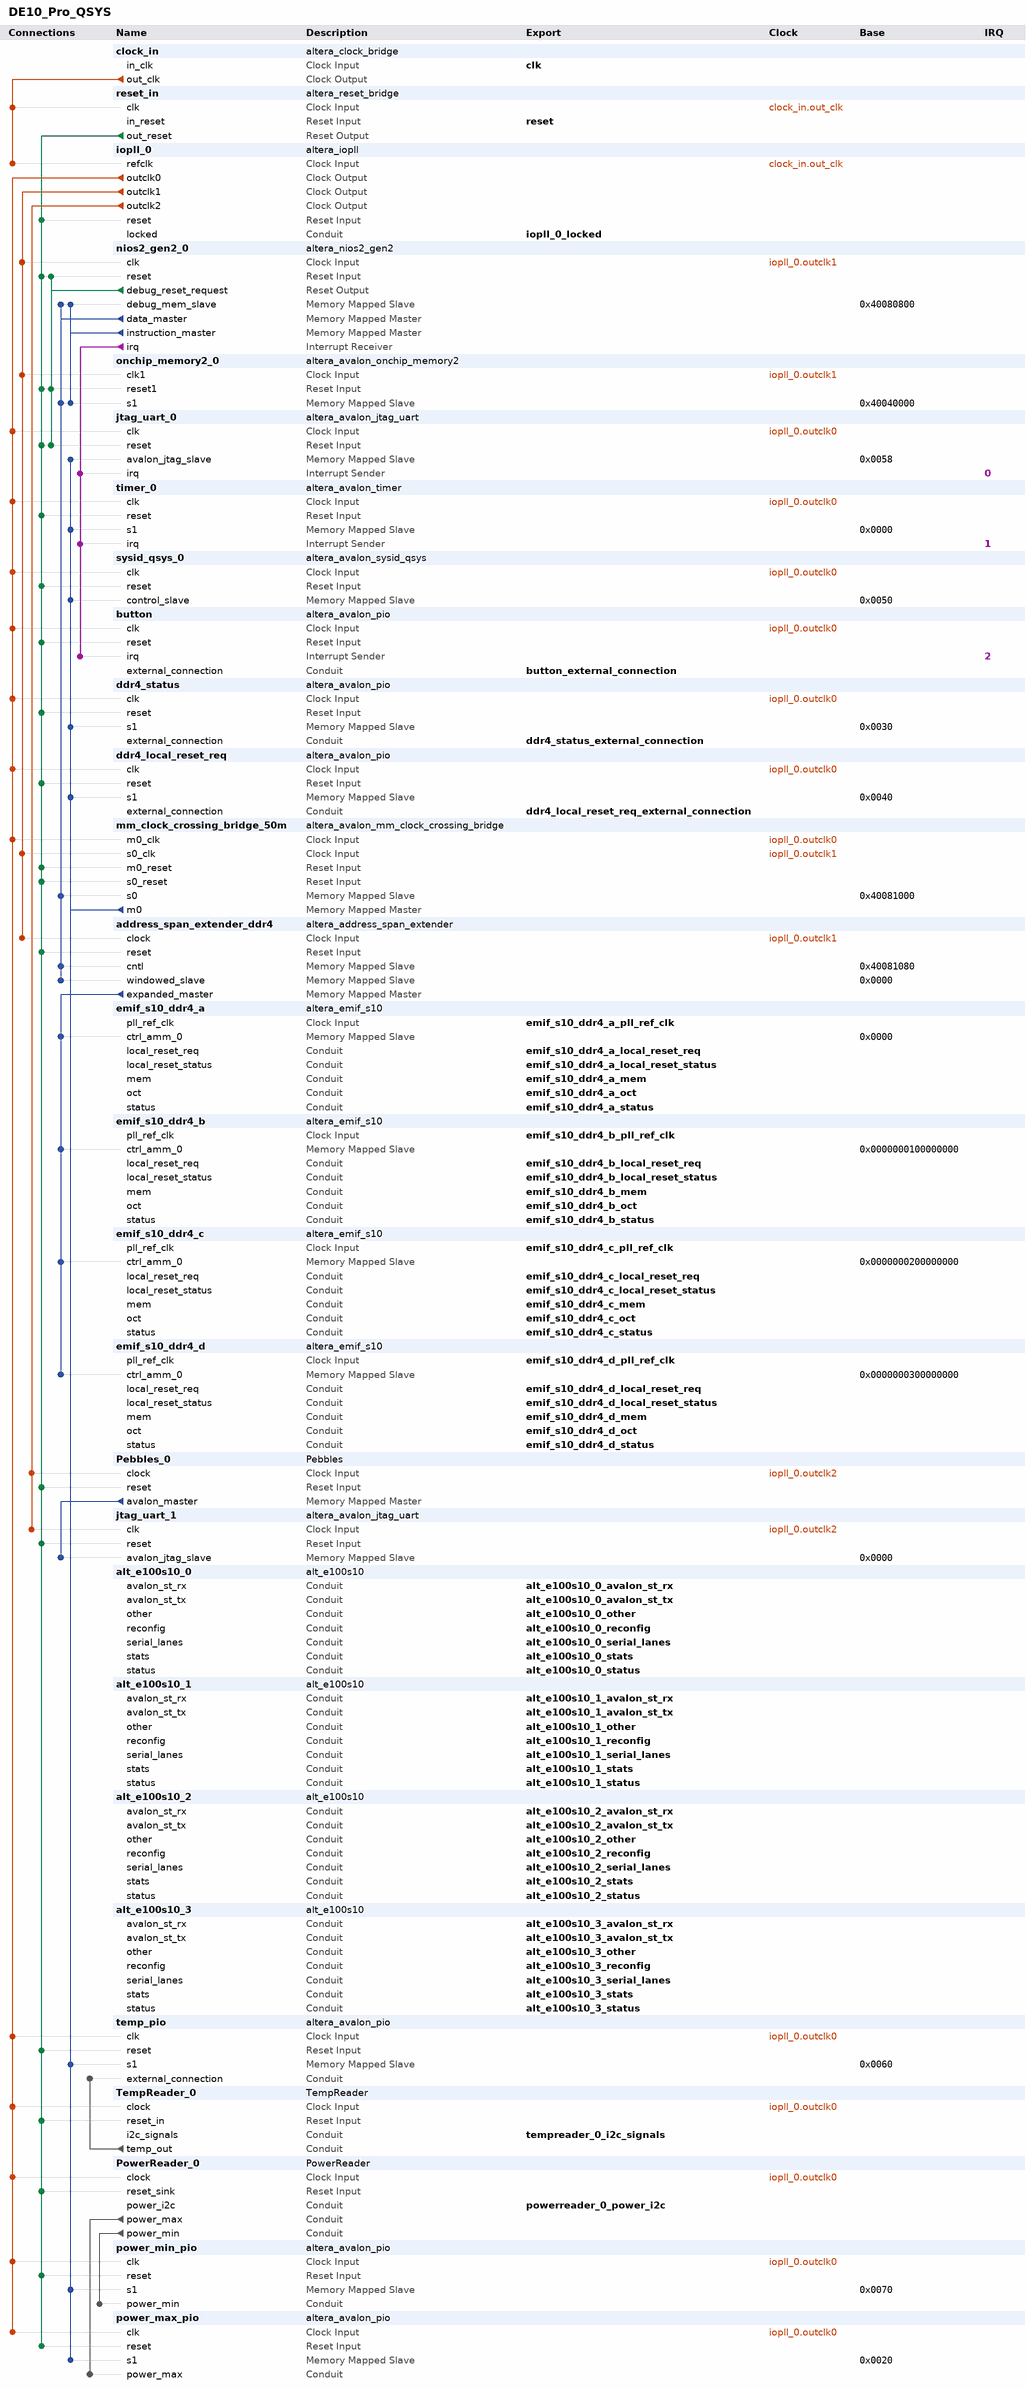
[diagram p0: system contents]
# Platform Designer (Qsys) system DE10_Pro_QSYS, Stratix 10 1SX280HU2F50E1VG
# Parameters at their usual value, and those the tool derives, are not listed.
package require -exact qsys 1.0
create_system DE10_Pro_QSYS
set_project_property DEVICE_FAMILY {Stratix 10}
set_project_property DEVICE 1SX280HU2F50E1VG

add_component clock_in ip/DE10_Pro_QSYS/DE10_Pro_QSYS_clock_in.ip altera_clock_bridge clock_in 19.1

add_component reset_in ip/DE10_Pro_QSYS/DE10_Pro_QSYS_reset_in.ip altera_reset_bridge reset_in 19.1

add_component iopll_0 ip/DE10_Pro_QSYS/DE10_Pro_QSYS_iopll_0.ip altera_iopll iopll_0 19.1
load_component iopll_0
set_component_parameter_value gui_device_family {Stratix 10}
set_component_parameter_value gui_device_component 1SX280HU2F50E1VG
set_component_parameter_value gui_device_speed_grade 1
set_component_parameter_value gui_debug_mode false
set_component_parameter_value gui_skip_sdc_generation false
set_component_parameter_value gui_include_iossm false
set_component_parameter_value gui_cal_code_hex_file iossm.hex
set_component_parameter_value gui_parameter_table_hex_file seq_params_sim.hex
set_component_parameter_value gui_pll_tclk_mux_en false
set_component_parameter_value gui_pll_tclk_sel pll_tclk_m_src
set_component_parameter_value gui_pll_vco_freq_band_0 pll_freq_clk0_disabled
set_component_parameter_value gui_pll_vco_freq_band_1 pll_freq_clk1_disabled
set_component_parameter_value gui_pll_freqcal_en true
set_component_parameter_value gui_pll_freqcal_req_flag true
set_component_parameter_value gui_cal_converge false
set_component_parameter_value gui_cal_error cal_clean
set_component_parameter_value gui_pll_cal_done false
set_component_parameter_value gui_pll_type S10_Simple
set_component_parameter_value gui_pll_m_cnt_in_src c_m_cnt_in_src_ph_mux_clk
set_component_parameter_value gui_c_cnt_in_src0 c_m_cnt_in_src_ph_mux_clk
set_component_parameter_value gui_c_cnt_in_src1 c_m_cnt_in_src_ph_mux_clk
set_component_parameter_value gui_c_cnt_in_src2 c_m_cnt_in_src_ph_mux_clk
set_component_parameter_value system_info_device_family {Stratix 10}
set_component_parameter_value system_info_device_component 1SX280HU2F50E1VG
set_component_parameter_value system_info_device_speed_grade 1
set_component_parameter_value system_part_trait_speed_grade 1
set_component_parameter_value gui_usr_device_speed_grade 1
set_component_parameter_value gui_location_type {I/O Bank}
set_component_parameter_value gui_use_logical false
set_component_parameter_value gui_reference_clock_frequency 50.0
set_component_parameter_value gui_reference_clock_frequency_ps 10000.0
set_component_parameter_value gui_use_coreclk false
set_component_parameter_value gui_refclk_might_change false
set_component_parameter_value gui_prot_mode UNUSED
set_component_parameter_value gui_use_locked true
set_component_parameter_value gui_lock_setting {Low Lock Time}
set_component_parameter_value gui_en_lvds_ports Disabled
set_component_parameter_value gui_operation_mode normal
set_component_parameter_value gui_clock_to_compensate 0
set_component_parameter_value gui_use_NDFB_modes false
set_component_parameter_value gui_number_of_clocks 3
set_component_parameter_value gui_fixed_vco_frequency_ps 1667.0
set_component_parameter_value gui_vco_frequency 600.0
set_component_parameter_value gui_mif_gen_options {Generate New MIF File}
set_component_parameter_value gui_new_mif_file_path {~/pll.mif}
set_component_parameter_value gui_existing_mif_file_path {~/pll.mif}
set_component_parameter_value gui_mif_config_name unnamed
set_component_parameter_value gui_enable_permit_cal false
set_component_parameter_value gui_clock_name_global false
set_component_parameter_value gui_output_clock_frequency0 50.0
set_component_parameter_value gui_output_clock_frequency1 200.0
set_component_parameter_value gui_output_clock_frequency2 150.0
set_component_parameter_value gui_output_clock_frequency_ps0 10000.0
set_component_parameter_value gui_output_clock_frequency_ps1 10000.0
set_component_parameter_value gui_output_clock_frequency_ps2 6666.667
set_component_parameter_value gui_actual_output_clock_frequency0 50.0
set_component_parameter_value gui_actual_output_clock_frequency1 200.0
set_component_parameter_value gui_actual_output_clock_frequency2 150.0
set_component_parameter_value gui_actual_output_clock_frequency_range0 49.666667,49.677419,49.6875,50.0,50.322581,50.333333
set_component_parameter_value gui_actual_output_clock_frequency_range1 191.666667,192.857143,193.75,200.0,207.142857,208.333333
set_component_parameter_value gui_actual_output_clock_frequency_range2 140.0,142.857143,145.454545,150.0,155.555556,160.0
set_component_parameter_value gui_actual_phase_shift0 0.0
set_component_parameter_value gui_actual_phase_shift1 0.0
set_component_parameter_value gui_actual_phase_shift2 0.0
set_component_parameter_value gui_actual_phase_shift_range0 0.0,104.2,208.3,312.5,416.7,520.8
set_component_parameter_value gui_actual_phase_shift_range1 0.0,104.2,208.3,312.5,416.7,520.8
set_component_parameter_value gui_actual_phase_shift_range2 0.0,104.2,208.3,312.5,416.7,520.8
set_component_parameter_value gui_actual_phase_shift_deg0 0.0
set_component_parameter_value gui_actual_phase_shift_deg1 0.0
set_component_parameter_value gui_actual_phase_shift_deg2 0.0
set_component_parameter_value gui_actual_phase_shift_deg_range0 0.0,1.9,3.8,5.6,7.5,9.4
set_component_parameter_value gui_actual_phase_shift_deg_range1 0.0,7.5,15.0,22.5,30.0,37.5
set_component_parameter_value gui_actual_phase_shift_deg_range2 0.0,5.6,11.2,16.9,22.5,28.1
set_component_parameter_value gui_actual_duty_cycle0 50.0
set_component_parameter_value gui_actual_duty_cycle1 50.0
set_component_parameter_value gui_actual_duty_cycle2 50.0
set_component_parameter_value gui_actual_duty_cycle_range0 43.75,45.83,47.92,50.0,52.08,54.17
set_component_parameter_value gui_actual_duty_cycle_range1 25.0,33.33,41.67,50.0,58.33,66.67
set_component_parameter_value gui_actual_duty_cycle_range2 31.25,37.5,43.75,50.0,56.25,62.5
set_component_parameter_value parameterTable_names {M-Counter Divide Setting,N-Counter Divide Setting,VCO Frequency,C-Counter-0 Divide Setting,C-Counter-1 Divide Setting,C-Counter-2 Divide Setting,C-Counter-3 Divide Setting,C-Counter-4 Divide Setting,C-Counter-5 Divide Setting,C-Counter-6 Divide Setting,C-Counter-7 Divide Setting,C-Counter-8 Divide Setting,PLL Auto Reset,M-Counter Hi Divide,M-Counter Lo Divide,M-Counter Even Duty Enable,M-Counter Bypass Enable,N-Counter Hi Divide,N-Counter Lo Divide,N-Counter Even Duty Enable,N-Counter Bypass Enable,C-Counter-0 Hi Divide,C-Counter-1 Hi Divide,C-Counter-2 Hi Divide,C-Counter-3 Hi Divide,C-Counter-4 Hi Divide,C-Counter-5 Hi Divide,C-Counter-6 Hi Divide,C-Counter-7 Hi Divide,C-Counter-8 Hi Divide,C-Counter-0 Lo Divide,C-Counter-1 Lo Divide,C-Counter-2 Lo Divide,C-Counter-3 Lo Divide,C-Counter-4 Lo Divide,C-Counter-5 Lo Divide,C-Counter-6 Lo Divide,C-Counter-7 Lo Divide,C-Counter-8 Lo Divide,C-Counter-0 Even Duty Enable,C-Counter-1 Even Duty Enable,C-Counter-2 Even Duty Enable,C-Counter-3 Even Duty Enable,C-Counter-4 Even Duty Enable,C-Counter-5 Even Duty Enable,C-Counter-6 Even Duty Enable,C-Counter-7 Even Duty Enable,C-Counter-8 Even Duty Enable,C-Counter-0 Bypass Enable,C-Counter-1 Bypass Enable,C-Counter-2 Bypass Enable,C-Counter-3 Bypass Enable,C-Counter-4 Bypass Enable,C-Counter-5 Bypass Enable,C-Counter-6 Bypass Enable,C-Counter-7 Bypass Enable,C-Counter-8 Bypass Enable,C-Counter-0 Preset,C-Counter-1 Preset,C-Counter-2 Preset,C-Counter-3 Preset,C-Counter-4 Preset,C-Counter-5 Preset,C-Counter-6 Preset,C-Counter-7 Preset,C-Counter-8 Preset,C-Counter-0 Phase Mux Preset,C-Counter-1 Phase Mux Preset,C-Counter-2 Phase Mux Preset,C-Counter-3 Phase Mux Preset,C-Counter-4 Phase Mux Preset,C-Counter-5 Phase Mux Preset,C-Counter-6 Phase Mux Preset,C-Counter-7 Phase Mux Preset,C-Counter-8 Phase Mux Preset,Charge Pump Current,Bandwidth Control}
set_component_parameter_value parameterTable_values {24,1,1200.0 MHz,24,6,8,1,1,1,1,1,1,false,12,12,false,false,256,256,false,true,12,3,4,256,256,256,256,256,256,12,3,4,256,256,256,256,256,256,false,false,false,false,false,false,false,false,false,false,false,false,true,true,true,true,true,true,1,1,1,1,1,1,1,1,1,0,0,0,0,0,0,0,0,0,pll_cp_setting4,pll_bw_res_setting4}
set_component_parameter_value mifTable_names {The MIF file specified does not yet exist}
set_component_parameter_value pll_m_cnt_basic 1
set_component_parameter_value pll_m_cnt 1
set_component_parameter_value prot_mode BASIC
set_component_parameter_value m_cnt_hi_div 12
set_component_parameter_value eff_m_cnt 1
set_component_parameter_value multiply_factor 24
set_component_parameter_value use_core_refclk false
set_component_parameter_value m_cnt_lo_div 12
set_component_parameter_value n_cnt_hi_div 256
set_component_parameter_value n_cnt_lo_div 256
set_component_parameter_value m_cnt_bypass_en false
set_component_parameter_value n_cnt_bypass_en true
set_component_parameter_value m_cnt_odd_div_duty_en false
set_component_parameter_value n_cnt_odd_div_duty_en false
set_component_parameter_value pll_vco_div 1
set_component_parameter_value pll_cp_current pll_cp_setting4
set_component_parameter_value pll_bwctrl pll_bw_res_setting4
set_component_parameter_value pll_ripplecap_ctrl pll_ripplecap_setting0
set_component_parameter_value pll_fractional_division 1
set_component_parameter_value fractional_vco_multiplier false
set_component_parameter_value reference_clock_frequency {50.0 MHz}
set_component_parameter_value pll_fractional_cout 1
set_component_parameter_value pll_dsm_out_sel 1st_order
set_component_parameter_value operation_mode normal
set_component_parameter_value number_of_clocks 3
set_component_parameter_value number_of_outclks 3
set_component_parameter_value pll_vcoph_div 1
set_component_parameter_value pll_type S10_Simple
set_component_parameter_value pll_subtype General
set_component_parameter_value pll_output_clk_frequency {1200.0 MHz}
set_component_parameter_value pll_pfd_frequency {50.0 MHz}
set_component_parameter_value mimic_fbclk_type gclk
set_component_parameter_value pll_bw_sel low_bw
set_component_parameter_value pll_slf_rst false
set_component_parameter_value pll_fbclk_mux_1 pll_fbclk_mux_1_glb
set_component_parameter_value pll_fbclk_mux_2 pll_fbclk_mux_2_fb_1
set_component_parameter_value pll_m_cnt_in_src c_m_cnt_in_src_ph_mux_clk
set_component_parameter_value pll_clkin_0_src clk_0
set_component_parameter_value refclk1_frequency {100.0 MHz}
set_component_parameter_value pll_clk_loss_sw_en false
set_component_parameter_value pll_manu_clk_sw_en false
set_component_parameter_value pll_auto_clk_sw_en false
set_component_parameter_value pll_clkin_1_src clk_0
set_component_parameter_value pll_clk_sw_dly 0
set_component_parameter_value pll_extclk_0_cnt_src pll_extclk_cnt_src_vss
set_component_parameter_value pll_extclk_1_cnt_src pll_extclk_cnt_src_vss
set_component_parameter_value pll_lock_fltr_cfg 100
set_component_parameter_value pll_unlock_fltr_cfg 2
set_component_parameter_value lock_mode low_lock_time
set_component_parameter_value clock_to_compensate 0
set_component_parameter_value clock_name_global false
set_component_parameter_value pll_freqcal_en true
set_component_parameter_value pll_defer_cal_user_mode false
set_component_parameter_value dprio_interface_sel 3
set_component_parameter_value merging_permitted false
set_component_parameter_value c_cnt_hi_div0 12
set_component_parameter_value c_cnt_hi_div1 3
set_component_parameter_value c_cnt_hi_div2 4
set_component_parameter_value c_cnt_hi_div3 256
set_component_parameter_value c_cnt_hi_div4 256
set_component_parameter_value c_cnt_hi_div5 256
set_component_parameter_value c_cnt_hi_div6 256
set_component_parameter_value c_cnt_hi_div7 256
set_component_parameter_value c_cnt_hi_div8 256
set_component_parameter_value c_cnt_hi_div9 1
set_component_parameter_value c_cnt_hi_div10 1
set_component_parameter_value c_cnt_hi_div11 1
set_component_parameter_value c_cnt_hi_div12 1
set_component_parameter_value c_cnt_hi_div13 1
set_component_parameter_value c_cnt_hi_div14 1
set_component_parameter_value c_cnt_hi_div15 1
set_component_parameter_value c_cnt_hi_div16 1
set_component_parameter_value c_cnt_hi_div17 1
set_component_parameter_value c_cnt_lo_div0 12
set_component_parameter_value c_cnt_lo_div1 3
set_component_parameter_value c_cnt_lo_div2 4
set_component_parameter_value c_cnt_lo_div3 256
set_component_parameter_value c_cnt_lo_div4 256
set_component_parameter_value c_cnt_lo_div5 256
set_component_parameter_value c_cnt_lo_div6 256
set_component_parameter_value c_cnt_lo_div7 256
set_component_parameter_value c_cnt_lo_div8 256
set_component_parameter_value c_cnt_lo_div9 1
set_component_parameter_value c_cnt_lo_div10 1
set_component_parameter_value c_cnt_lo_div11 1
set_component_parameter_value c_cnt_lo_div12 1
set_component_parameter_value c_cnt_lo_div13 1
set_component_parameter_value c_cnt_lo_div14 1
set_component_parameter_value c_cnt_lo_div15 1
set_component_parameter_value c_cnt_lo_div16 1
set_component_parameter_value c_cnt_lo_div17 1
set_component_parameter_value c_cnt_prst0 1
set_component_parameter_value c_cnt_prst1 1
set_component_parameter_value c_cnt_prst2 1
set_component_parameter_value c_cnt_prst3 1
set_component_parameter_value c_cnt_prst4 1
set_component_parameter_value c_cnt_prst5 1
set_component_parameter_value c_cnt_prst6 1
set_component_parameter_value c_cnt_prst7 1
set_component_parameter_value c_cnt_prst8 1
set_component_parameter_value c_cnt_prst9 1
set_component_parameter_value c_cnt_prst10 1
set_component_parameter_value c_cnt_prst11 1
set_component_parameter_value c_cnt_prst12 1
set_component_parameter_value c_cnt_prst13 1
set_component_parameter_value c_cnt_prst14 1
set_component_parameter_value c_cnt_prst15 1
set_component_parameter_value c_cnt_prst16 1
set_component_parameter_value c_cnt_prst17 1
set_component_parameter_value c_cnt_ph_mux_prst0 0
set_component_parameter_value c_cnt_ph_mux_prst1 0
set_component_parameter_value c_cnt_ph_mux_prst2 0
set_component_parameter_value c_cnt_ph_mux_prst3 0
set_component_parameter_value c_cnt_ph_mux_prst4 0
set_component_parameter_value c_cnt_ph_mux_prst5 0
set_component_parameter_value c_cnt_ph_mux_prst6 0
set_component_parameter_value c_cnt_ph_mux_prst7 0
set_component_parameter_value c_cnt_ph_mux_prst8 0
set_component_parameter_value c_cnt_ph_mux_prst9 0
set_component_parameter_value c_cnt_ph_mux_prst10 0
set_component_parameter_value c_cnt_ph_mux_prst11 0
set_component_parameter_value c_cnt_ph_mux_prst12 0
set_component_parameter_value c_cnt_ph_mux_prst13 0
set_component_parameter_value c_cnt_ph_mux_prst14 0
set_component_parameter_value c_cnt_ph_mux_prst15 0
set_component_parameter_value c_cnt_ph_mux_prst16 0
set_component_parameter_value c_cnt_ph_mux_prst17 0
set_component_parameter_value c_cnt_in_src0 c_m_cnt_in_src_ph_mux_clk
set_component_parameter_value c_cnt_in_src1 c_m_cnt_in_src_ph_mux_clk
set_component_parameter_value c_cnt_in_src2 c_m_cnt_in_src_ph_mux_clk
set_component_parameter_value c_cnt_in_src3 c_m_cnt_in_src_ph_mux_clk
set_component_parameter_value c_cnt_in_src4 c_m_cnt_in_src_ph_mux_clk
set_component_parameter_value c_cnt_in_src5 c_m_cnt_in_src_ph_mux_clk
set_component_parameter_value c_cnt_in_src6 c_m_cnt_in_src_ph_mux_clk
set_component_parameter_value c_cnt_in_src7 c_m_cnt_in_src_ph_mux_clk
set_component_parameter_value c_cnt_in_src8 c_m_cnt_in_src_ph_mux_clk
set_component_parameter_value c_cnt_in_src9 c_m_cnt_in_src_ph_mux_clk
set_component_parameter_value c_cnt_in_src10 c_m_cnt_in_src_ph_mux_clk
set_component_parameter_value c_cnt_in_src11 c_m_cnt_in_src_ph_mux_clk
set_component_parameter_value c_cnt_in_src12 c_m_cnt_in_src_ph_mux_clk
set_component_parameter_value c_cnt_in_src13 c_m_cnt_in_src_ph_mux_clk
set_component_parameter_value c_cnt_in_src14 c_m_cnt_in_src_ph_mux_clk
set_component_parameter_value c_cnt_in_src15 c_m_cnt_in_src_ph_mux_clk
set_component_parameter_value c_cnt_in_src16 c_m_cnt_in_src_ph_mux_clk
set_component_parameter_value c_cnt_in_src17 c_m_cnt_in_src_ph_mux_clk
set_component_parameter_value c_cnt_bypass_en0 false
set_component_parameter_value c_cnt_bypass_en1 false
set_component_parameter_value c_cnt_bypass_en2 false
set_component_parameter_value c_cnt_bypass_en3 true
set_component_parameter_value c_cnt_bypass_en4 true
set_component_parameter_value c_cnt_bypass_en5 true
set_component_parameter_value c_cnt_bypass_en6 true
set_component_parameter_value c_cnt_bypass_en7 true
set_component_parameter_value c_cnt_bypass_en8 true
set_component_parameter_value c_cnt_bypass_en9 true
set_component_parameter_value c_cnt_bypass_en10 true
set_component_parameter_value c_cnt_bypass_en11 true
set_component_parameter_value c_cnt_bypass_en12 true
set_component_parameter_value c_cnt_bypass_en13 true
set_component_parameter_value c_cnt_bypass_en14 true
set_component_parameter_value c_cnt_bypass_en15 true
set_component_parameter_value c_cnt_bypass_en16 true
set_component_parameter_value c_cnt_bypass_en17 true
set_component_parameter_value c_cnt_odd_div_duty_en0 false
set_component_parameter_value c_cnt_odd_div_duty_en1 false
set_component_parameter_value c_cnt_odd_div_duty_en2 false
set_component_parameter_value c_cnt_odd_div_duty_en3 false
set_component_parameter_value c_cnt_odd_div_duty_en4 false
set_component_parameter_value c_cnt_odd_div_duty_en5 false
set_component_parameter_value c_cnt_odd_div_duty_en6 false
set_component_parameter_value c_cnt_odd_div_duty_en7 false
set_component_parameter_value c_cnt_odd_div_duty_en8 false
set_component_parameter_value c_cnt_odd_div_duty_en9 false
set_component_parameter_value c_cnt_odd_div_duty_en10 false
set_component_parameter_value c_cnt_odd_div_duty_en11 false
set_component_parameter_value c_cnt_odd_div_duty_en12 false
set_component_parameter_value c_cnt_odd_div_duty_en13 false
set_component_parameter_value c_cnt_odd_div_duty_en14 false
set_component_parameter_value c_cnt_odd_div_duty_en15 false
set_component_parameter_value c_cnt_odd_div_duty_en16 false
set_component_parameter_value c_cnt_odd_div_duty_en17 false
set_component_parameter_value output_clock_frequency0 {50.0 MHz}
set_component_parameter_value output_clock_frequency1 {200.0 MHz}
set_component_parameter_value output_clock_frequency2 {150.0 MHz}
set_component_parameter_value output_clock_frequency3 {0 ps}
set_component_parameter_value output_clock_frequency4 {0 ps}
set_component_parameter_value output_clock_frequency5 {0 ps}
set_component_parameter_value output_clock_frequency6 {0 ps}
set_component_parameter_value output_clock_frequency7 {0 ps}
set_component_parameter_value output_clock_frequency8 {0 ps}
set_component_parameter_value output_clock_frequency9 {0 MHz}
set_component_parameter_value output_clock_frequency10 {0 MHz}
set_component_parameter_value output_clock_frequency11 {0 MHz}
set_component_parameter_value output_clock_frequency12 {0 MHz}
set_component_parameter_value output_clock_frequency13 {0 MHz}
set_component_parameter_value output_clock_frequency14 {0 MHz}
set_component_parameter_value output_clock_frequency15 {0 MHz}
set_component_parameter_value output_clock_frequency16 {0 MHz}
set_component_parameter_value output_clock_frequency17 {0 MHz}
set_component_parameter_value phase_shift0 {0 ps}
set_component_parameter_value phase_shift1 {0 ps}
set_component_parameter_value phase_shift2 {0 ps}
set_component_parameter_value phase_shift3 {0 ps}
set_component_parameter_value phase_shift4 {0 ps}
set_component_parameter_value phase_shift5 {0 ps}
set_component_parameter_value phase_shift6 {0 ps}
set_component_parameter_value phase_shift7 {0 ps}
set_component_parameter_value phase_shift8 {0 ps}
set_component_parameter_value phase_shift9 {0 ps}
set_component_parameter_value phase_shift10 {0 ps}
set_component_parameter_value phase_shift11 {0 ps}
set_component_parameter_value phase_shift12 {0 ps}
set_component_parameter_value phase_shift13 {0 ps}
set_component_parameter_value phase_shift14 {0 ps}
set_component_parameter_value phase_shift15 {0 ps}
set_component_parameter_value phase_shift16 {0 ps}
set_component_parameter_value phase_shift17 {0 ps}
set_component_parameter_value duty_cycle0 50
set_component_parameter_value duty_cycle1 50
set_component_parameter_value duty_cycle2 50
set_component_parameter_value duty_cycle3 50
set_component_parameter_value duty_cycle4 50
set_component_parameter_value duty_cycle5 50
set_component_parameter_value duty_cycle6 50
set_component_parameter_value duty_cycle7 50
set_component_parameter_value duty_cycle8 50
set_component_parameter_value duty_cycle9 50
set_component_parameter_value duty_cycle10 50
set_component_parameter_value duty_cycle11 50
set_component_parameter_value duty_cycle12 50
set_component_parameter_value duty_cycle13 50
set_component_parameter_value duty_cycle14 50
set_component_parameter_value duty_cycle15 50
set_component_parameter_value duty_cycle16 50
set_component_parameter_value duty_cycle17 50
set_component_parameter_value clock_name_0 outclk0
set_component_parameter_value clock_name_1 outclk1
set_component_parameter_value clock_name_2 outclk2
set_component_parameter_value clock_name_global_0 false
set_component_parameter_value clock_name_global_1 false
set_component_parameter_value clock_name_global_2 false
set_component_parameter_value clock_name_global_3 false
set_component_parameter_value clock_name_global_4 false
set_component_parameter_value clock_name_global_5 false
set_component_parameter_value clock_name_global_6 false
set_component_parameter_value clock_name_global_7 false
set_component_parameter_value clock_name_global_8 false
set_component_parameter_value divide_factor0 1
set_component_parameter_value divide_factor1 1
set_component_parameter_value divide_factor2 1
set_component_parameter_value divide_factor3 1
set_component_parameter_value divide_factor4 1
set_component_parameter_value divide_factor5 1
set_component_parameter_value divide_factor6 1
set_component_parameter_value divide_factor7 1
set_component_parameter_value divide_factor8 1
set_component_parameter_value pll_tclk_mux_en false
set_component_parameter_value pll_tclk_sel pll_tclk_m_src
set_component_parameter_value pll_vco_freq_band_0 pll_freq_clk0_disabled
set_component_parameter_value pll_vco_freq_band_1 pll_freq_clk1_disabled
set_component_parameter_value pll_freqcal_req_flag true
set_component_parameter_value cal_converge false
set_component_parameter_value cal_error cal_clean
set_component_parameter_value pll_cal_done false
set_component_parameter_value include_iossm false
set_component_parameter_value cal_code_hex_file iossm.hex
set_component_parameter_value parameter_table_hex_file seq_params_sim.hex
set_component_parameter_value iossm_nios_sim_clk_period_ps 1333
set_component_parameter_value hp_number_of_family_allowable_clocks 9
set_component_parameter_value hp_previous_num_clocks 1
set_component_parameter_value hp_actual_vco_frequency_fp 600.0
set_component_parameter_value hp_qsys_scripting_mode false
set_component_parameter_value hp_actual_output_clock_frequency_fp0 50.0
set_component_parameter_value hp_actual_output_clock_frequency_fp1 200.0
set_component_parameter_value hp_actual_output_clock_frequency_fp2 150.0
set_component_parameter_value hp_actual_output_clock_frequency_fp3 100.0
set_component_parameter_value hp_actual_output_clock_frequency_fp4 100.0
set_component_parameter_value hp_actual_output_clock_frequency_fp5 100.0
set_component_parameter_value hp_actual_output_clock_frequency_fp6 100.0
set_component_parameter_value hp_actual_output_clock_frequency_fp7 100.0
set_component_parameter_value hp_actual_output_clock_frequency_fp8 100.0
set_component_parameter_value hp_actual_output_clock_frequency_fp9 100.0
set_component_parameter_value hp_actual_output_clock_frequency_fp10 100.0
set_component_parameter_value hp_actual_output_clock_frequency_fp11 100.0
set_component_parameter_value hp_actual_output_clock_frequency_fp12 100.0
set_component_parameter_value hp_actual_output_clock_frequency_fp13 100.0
set_component_parameter_value hp_actual_output_clock_frequency_fp14 100.0
set_component_parameter_value hp_actual_output_clock_frequency_fp15 100.0
set_component_parameter_value hp_actual_output_clock_frequency_fp16 100.0
set_component_parameter_value hp_actual_output_clock_frequency_fp17 100.0
set_component_parameter_value hp_actual_phase_shift_fp0 0.0
set_component_parameter_value hp_actual_phase_shift_fp1 0.0
set_component_parameter_value hp_actual_phase_shift_fp2 0.0
set_component_parameter_value hp_actual_phase_shift_fp3 0.0
set_component_parameter_value hp_actual_phase_shift_fp4 0.0
set_component_parameter_value hp_actual_phase_shift_fp5 0.0
set_component_parameter_value hp_actual_phase_shift_fp6 0.0
set_component_parameter_value hp_actual_phase_shift_fp7 0.0
set_component_parameter_value hp_actual_phase_shift_fp8 0.0
set_component_parameter_value hp_actual_phase_shift_fp9 0.0
set_component_parameter_value hp_actual_phase_shift_fp10 0.0
set_component_parameter_value hp_actual_phase_shift_fp11 0.0
set_component_parameter_value hp_actual_phase_shift_fp12 0.0
set_component_parameter_value hp_actual_phase_shift_fp13 0.0
set_component_parameter_value hp_actual_phase_shift_fp14 0.0
set_component_parameter_value hp_actual_phase_shift_fp15 0.0
set_component_parameter_value hp_actual_phase_shift_fp16 0.0
set_component_parameter_value hp_actual_phase_shift_fp17 0.0
set_component_parameter_value hp_actual_duty_cycle_fp0 50.0
set_component_parameter_value hp_actual_duty_cycle_fp1 50.0
set_component_parameter_value hp_actual_duty_cycle_fp2 50.0
set_component_parameter_value hp_actual_duty_cycle_fp3 50.0
set_component_parameter_value hp_actual_duty_cycle_fp4 50.0
set_component_parameter_value hp_actual_duty_cycle_fp5 50.0
set_component_parameter_value hp_actual_duty_cycle_fp6 50.0
set_component_parameter_value hp_actual_duty_cycle_fp7 50.0
set_component_parameter_value hp_actual_duty_cycle_fp8 50.0
set_component_parameter_value hp_actual_duty_cycle_fp9 50.0
set_component_parameter_value hp_actual_duty_cycle_fp10 50.0
set_component_parameter_value hp_actual_duty_cycle_fp11 50.0
set_component_parameter_value hp_actual_duty_cycle_fp12 50.0
set_component_parameter_value hp_actual_duty_cycle_fp13 50.0
set_component_parameter_value hp_actual_duty_cycle_fp14 50.0
set_component_parameter_value hp_actual_duty_cycle_fp15 50.0
set_component_parameter_value hp_actual_duty_cycle_fp16 50.0
set_component_parameter_value hp_actual_duty_cycle_fp17 50.0
save_component

add_component nios2_gen2_0 ip/DE10_Pro_QSYS/DE10_Pro_QSYS_nios2_gen2_0.ip altera_nios2_gen2 nios2_gen2_0 19.1
load_component nios2_gen2_0
set_component_parameter_value setting_support31bitdcachebypass false
set_component_parameter_value resetSlave onchip_memory2_0.s1
set_component_parameter_value exceptionSlave onchip_memory2_0.s1
set_component_parameter_value impl Fast
set_component_parameter_value icache_size 2048
set_component_parameter_value dcache_size 2048
save_component

add_component onchip_memory2_0 ip/DE10_Pro_QSYS/DE10_Pro_QSYS_onchip_memory2_0.ip altera_avalon_onchip_memory2 onchip_memory2_0 19.1
load_component onchip_memory2_0
set_component_parameter_value dataWidth 32
set_component_parameter_value dualPort false
set_component_parameter_value initMemContent true
set_component_parameter_value initializationFileName onchip_mem.hex
set_component_parameter_value memorySize 256000
save_component

add_component jtag_uart_0 ip/DE10_Pro_QSYS/DE10_Pro_QSYS_jtag_uart_0.ip altera_avalon_jtag_uart jtag_uart_0 19.1

add_component timer_0 ip/DE10_Pro_QSYS/DE10_Pro_QSYS_timer_0.ip altera_avalon_timer timer_0 19.1
load_component timer_0
set_component_parameter_value period 1
set_component_parameter_value periodUnits MSEC
set_component_parameter_value timerPreset FULL_FEATURED
save_component

add_component sysid_qsys_0 ip/DE10_Pro_QSYS/DE10_Pro_QSYS_sysid_qsys_0.ip altera_avalon_sysid_qsys sysid_qsys_0 19.1
load_component sysid_qsys_0
set_component_parameter_value id 0
set_component_parameter_value ID_VALUE 0
set_component_parameter_value TIMESTAMP 0
save_component

add_component button ip/DE10_Pro_QSYS/DE10_Pro_QSYS_button.ip altera_avalon_pio button 19.1
load_component button
set_component_parameter_value captureEdge true
set_component_parameter_value direction Input
set_component_parameter_value edgeType ANY
set_component_parameter_value generateIRQ true
set_component_parameter_value irqType EDGE
set_component_parameter_value width 2
save_component

add_component ddr4_status ip/DE10_Pro_QSYS/DE10_Pro_QSYS_pio_0.ip altera_avalon_pio ddr4_status 19.1

add_component ddr4_local_reset_req ip/DE10_Pro_QSYS/DE10_Pro_QSYS_ddr4_local_reset_req.ip altera_avalon_pio ddr4_local_reset_req 19.1
load_component ddr4_local_reset_req
set_component_parameter_value direction Output
set_component_parameter_value width 1
save_component

add_component mm_clock_crossing_bridge_50m ip/DE10_Pro_QSYS/DE10_Pro_QSYS_mm_clock_crossing_bridge_50m.ip altera_avalon_mm_clock_crossing_bridge mm_clock_crossing_bridge_50m 19.1
load_component mm_clock_crossing_bridge_50m
set_component_parameter_value DATA_WIDTH 32
set_component_parameter_value ADDRESS_WIDTH 10
set_component_parameter_value USE_AUTO_ADDRESS_WIDTH 1
set_component_parameter_value MAX_BURST_SIZE 1
set_component_parameter_value COMMAND_FIFO_DEPTH 4
set_component_parameter_value RESPONSE_FIFO_DEPTH 4
set_component_parameter_value MASTER_SYNC_DEPTH 2
set_component_parameter_value SLAVE_SYNC_DEPTH 2
set_component_parameter_value SYNC_RESET 0
save_component

add_component address_span_extender_ddr4 ip/DE10_Pro_QSYS/DE10_Pro_QSYS_address_span_extender_ddr4.ip altera_address_span_extender address_span_extender_ddr4 19.1
load_component address_span_extender_ddr4
set_component_parameter_value DATA_WIDTH 32
set_component_parameter_value MASTER_ADDRESS_WIDTH 34
set_component_parameter_value SLAVE_ADDRESS_WIDTH 28
set_component_parameter_value BURSTCOUNT_WIDTH 1
set_component_parameter_value MASTER_ADDRESS_DEF 0
set_component_parameter_value ENABLE_SLAVE_PORT true
set_component_parameter_value MAX_PENDING_READS 1
set_component_parameter_value SYNC_RESET 0
save_component

add_component emif_s10_ddr4_a ip/DE10_Pro_QSYS/DE10_Pro_QSYS_emif_s10_ddr4.ip altera_emif_s10 emif_s10_ddr4_a 19.1.0
load_component emif_s10_ddr4_a
set_component_parameter_value FAMILY_ENUM FAMILY_STRATIX10
set_component_parameter_value TRAIT_SUPPORTS_VID 1
set_component_parameter_value PROTOCOL_ENUM PROTOCOL_DDR4
set_component_parameter_value IS_ED_SLAVE false
set_component_parameter_value INTERNAL_TESTING_MODE false
set_component_parameter_value CAL_DEBUG_CLOCK_FREQUENCY 50000000
set_component_parameter_value PREV_PROTOCOL_ENUM PROTOCOL_DDR4
set_component_parameter_value PHY_FPGA_SPEEDGRADE_GUI {E1V (Production) - change device under 'View'->'Device Family'}
set_component_parameter_value PHY_TARGET_SPEEDGRADE E1V
set_component_parameter_value PHY_TARGET_IS_ES false
set_component_parameter_value PHY_TARGET_IS_ES2 false
set_component_parameter_value PHY_TARGET_IS_ES3 false
set_component_parameter_value PHY_TARGET_IS_PRODUCTION true
set_component_parameter_value PHY_CONFIG_ENUM CONFIG_PHY_AND_HARD_CTRL
set_component_parameter_value PHY_PING_PONG_EN false
set_component_parameter_value PHY_CLAMSHELL_EN false
set_component_parameter_value PHY_RATE_ENUM RATE_QUARTER
set_component_parameter_value PHY_MEM_CLK_FREQ_MHZ 1066.666666
set_component_parameter_value PHY_REF_CLK_FREQ_MHZ 266.667
set_component_parameter_value PHY_REF_CLK_JITTER_PS 10.0
set_component_parameter_value PHY_DLL_CORE_UPDN_EN false
set_component_parameter_value PHY_CORE_CLKS_SHARING_ENUM CORE_CLKS_SHARING_DISABLED
set_component_parameter_value PHY_CORE_CLKS_SHARING_EXPOSE_SLAVE_OUT false
set_component_parameter_value PHY_CALIBRATED_OCT true
set_component_parameter_value PHY_AC_CALIBRATED_OCT true
set_component_parameter_value PHY_CK_CALIBRATED_OCT true
set_component_parameter_value PHY_DATA_CALIBRATED_OCT true
set_component_parameter_value PHY_RZQ 240
set_component_parameter_value PHY_HPS_ENABLE_EARLY_RELEASE false
set_component_parameter_value PHY_USER_PERIODIC_OCT_RECAL_ENUM PERIODIC_OCT_RECAL_AUTO
set_component_parameter_value PHY_AC_IO_STD_ENUM IO_STD_SSTL_12
set_component_parameter_value PHY_CK_IO_STD_ENUM IO_STD_SSTL_12
set_component_parameter_value PHY_DATA_IO_STD_ENUM IO_STD_POD_12
set_component_parameter_value PHY_AC_MODE_ENUM OUT_OCT_40_CAL
set_component_parameter_value PHY_CK_MODE_ENUM OUT_OCT_40_CAL
set_component_parameter_value PHY_DATA_OUT_MODE_ENUM OUT_OCT_34_CAL
set_component_parameter_value PLL_ADD_EXTRA_CLKS false
set_component_parameter_value PLL_USER_NUM_OF_EXTRA_CLKS 0
set_component_parameter_value PLL_EXTRA_CLK_ACTUAL_FREQ_MHZ_GUI_0 0.0
set_component_parameter_value PLL_EXTRA_CLK_ACTUAL_PHASE_PS_GUI_0 0.0
set_component_parameter_value PLL_EXTRA_CLK_DESIRED_FREQ_MHZ_GUI_0 0.0
set_component_parameter_value PLL_EXTRA_CLK_PHASE_SHIFT_UNIT_GUI_0 ps
set_component_parameter_value PLL_EXTRA_CLK_DESIRED_PHASE_GUI_0 0.0
set_component_parameter_value PLL_EXTRA_CLK_ACTUAL_PHASE_DEG_GUI_0 0.0
set_component_parameter_value PLL_EXTRA_CLK_DESIRED_DUTY_CYCLE_GUI_0 50.0
set_component_parameter_value PLL_EXTRA_CLK_ACTUAL_DUTY_CYCLE_GUI_0 50.0
set_component_parameter_value PLL_EXTRA_CLK_ACTUAL_DUTY_CYCLE_0 50.0
set_component_parameter_value PLL_EXTRA_CLK_ACTUAL_FREQ_MHZ_GUI_1 0.0
set_component_parameter_value PLL_EXTRA_CLK_ACTUAL_PHASE_PS_GUI_1 0.0
set_component_parameter_value PLL_EXTRA_CLK_DESIRED_FREQ_MHZ_GUI_1 0.0
set_component_parameter_value PLL_EXTRA_CLK_PHASE_SHIFT_UNIT_GUI_1 ps
set_component_parameter_value PLL_EXTRA_CLK_DESIRED_PHASE_GUI_1 0.0
set_component_parameter_value PLL_EXTRA_CLK_ACTUAL_PHASE_DEG_GUI_1 0.0
set_component_parameter_value PLL_EXTRA_CLK_DESIRED_DUTY_CYCLE_GUI_1 50.0
set_component_parameter_value PLL_EXTRA_CLK_ACTUAL_DUTY_CYCLE_GUI_1 50.0
set_component_parameter_value PLL_EXTRA_CLK_ACTUAL_DUTY_CYCLE_1 50.0
set_component_parameter_value PLL_EXTRA_CLK_ACTUAL_FREQ_MHZ_GUI_2 0.0
set_component_parameter_value PLL_EXTRA_CLK_ACTUAL_PHASE_PS_GUI_2 0.0
set_component_parameter_value PLL_EXTRA_CLK_DESIRED_FREQ_MHZ_GUI_2 0.0
set_component_parameter_value PLL_EXTRA_CLK_PHASE_SHIFT_UNIT_GUI_2 ps
set_component_parameter_value PLL_EXTRA_CLK_DESIRED_PHASE_GUI_2 0.0
set_component_parameter_value PLL_EXTRA_CLK_ACTUAL_PHASE_DEG_GUI_2 0.0
set_component_parameter_value PLL_EXTRA_CLK_DESIRED_DUTY_CYCLE_GUI_2 50.0
set_component_parameter_value PLL_EXTRA_CLK_ACTUAL_DUTY_CYCLE_GUI_2 50.0
set_component_parameter_value PLL_EXTRA_CLK_ACTUAL_DUTY_CYCLE_2 50.0
set_component_parameter_value PLL_EXTRA_CLK_ACTUAL_FREQ_MHZ_GUI_3 0.0
set_component_parameter_value PLL_EXTRA_CLK_ACTUAL_PHASE_PS_GUI_3 0.0
set_component_parameter_value PLL_EXTRA_CLK_DESIRED_FREQ_MHZ_GUI_3 0.0
set_component_parameter_value PLL_EXTRA_CLK_PHASE_SHIFT_UNIT_GUI_3 ps
set_component_parameter_value PLL_EXTRA_CLK_DESIRED_PHASE_GUI_3 0.0
set_component_parameter_value PLL_EXTRA_CLK_ACTUAL_PHASE_DEG_GUI_3 0.0
set_component_parameter_value PLL_EXTRA_CLK_DESIRED_DUTY_CYCLE_GUI_3 50.0
set_component_parameter_value PLL_EXTRA_CLK_ACTUAL_DUTY_CYCLE_GUI_3 50.0
set_component_parameter_value PLL_EXTRA_CLK_ACTUAL_DUTY_CYCLE_3 50.0
set_component_parameter_value PLL_EXTRA_CLK_ACTUAL_FREQ_MHZ_GUI_4 0.0
set_component_parameter_value PLL_EXTRA_CLK_ACTUAL_PHASE_PS_GUI_4 0.0
set_component_parameter_value PLL_EXTRA_CLK_DESIRED_FREQ_MHZ_GUI_4 0.0
set_component_parameter_value PLL_EXTRA_CLK_PHASE_SHIFT_UNIT_GUI_4 ps
set_component_parameter_value PLL_EXTRA_CLK_DESIRED_PHASE_GUI_4 0.0
set_component_parameter_value PLL_EXTRA_CLK_ACTUAL_PHASE_DEG_GUI_4 0.0
set_component_parameter_value PLL_EXTRA_CLK_DESIRED_DUTY_CYCLE_GUI_4 50.0
set_component_parameter_value PLL_EXTRA_CLK_ACTUAL_DUTY_CYCLE_GUI_4 50.0
set_component_parameter_value PLL_EXTRA_CLK_ACTUAL_DUTY_CYCLE_4 50.0
set_component_parameter_value PLL_EXTRA_CLK_ACTUAL_FREQ_MHZ_GUI_5 0.0
set_component_parameter_value PLL_EXTRA_CLK_ACTUAL_PHASE_PS_GUI_5 0.0
set_component_parameter_value PLL_EXTRA_CLK_DESIRED_FREQ_MHZ_GUI_5 0.0
set_component_parameter_value PLL_EXTRA_CLK_PHASE_SHIFT_UNIT_GUI_5 ps
set_component_parameter_value PLL_EXTRA_CLK_DESIRED_PHASE_GUI_5 0.0
set_component_parameter_value PLL_EXTRA_CLK_ACTUAL_PHASE_DEG_GUI_5 0.0
set_component_parameter_value PLL_EXTRA_CLK_DESIRED_DUTY_CYCLE_GUI_5 50.0
set_component_parameter_value PLL_EXTRA_CLK_ACTUAL_DUTY_CYCLE_GUI_5 50.0
set_component_parameter_value PLL_EXTRA_CLK_ACTUAL_DUTY_CYCLE_5 50.0
set_component_parameter_value PLL_EXTRA_CLK_ACTUAL_FREQ_MHZ_GUI_6 0.0
set_component_parameter_value PLL_EXTRA_CLK_ACTUAL_PHASE_PS_GUI_6 0.0
set_component_parameter_value PLL_EXTRA_CLK_DESIRED_FREQ_MHZ_GUI_6 0.0
set_component_parameter_value PLL_EXTRA_CLK_PHASE_SHIFT_UNIT_GUI_6 ps
set_component_parameter_value PLL_EXTRA_CLK_DESIRED_PHASE_GUI_6 0.0
set_component_parameter_value PLL_EXTRA_CLK_ACTUAL_PHASE_DEG_GUI_6 0.0
set_component_parameter_value PLL_EXTRA_CLK_DESIRED_DUTY_CYCLE_GUI_6 50.0
set_component_parameter_value PLL_EXTRA_CLK_ACTUAL_DUTY_CYCLE_GUI_6 50.0
set_component_parameter_value PLL_EXTRA_CLK_ACTUAL_DUTY_CYCLE_6 50.0
set_component_parameter_value PLL_EXTRA_CLK_ACTUAL_FREQ_MHZ_GUI_7 0.0
set_component_parameter_value PLL_EXTRA_CLK_ACTUAL_PHASE_PS_GUI_7 0.0
set_component_parameter_value PLL_EXTRA_CLK_DESIRED_FREQ_MHZ_GUI_7 0.0
set_component_parameter_value PLL_EXTRA_CLK_PHASE_SHIFT_UNIT_GUI_7 ps
set_component_parameter_value PLL_EXTRA_CLK_DESIRED_PHASE_GUI_7 0.0
set_component_parameter_value PLL_EXTRA_CLK_ACTUAL_PHASE_DEG_GUI_7 0.0
set_component_parameter_value PLL_EXTRA_CLK_DESIRED_DUTY_CYCLE_GUI_7 50.0
set_component_parameter_value PLL_EXTRA_CLK_ACTUAL_DUTY_CYCLE_GUI_7 50.0
set_component_parameter_value PLL_EXTRA_CLK_ACTUAL_DUTY_CYCLE_7 50.0
set_component_parameter_value PLL_EXTRA_CLK_ACTUAL_FREQ_MHZ_GUI_8 0.0
set_component_parameter_value PLL_EXTRA_CLK_ACTUAL_PHASE_PS_GUI_8 0.0
set_component_parameter_value PLL_EXTRA_CLK_DESIRED_FREQ_MHZ_GUI_8 0.0
set_component_parameter_value PLL_EXTRA_CLK_PHASE_SHIFT_UNIT_GUI_8 ps
set_component_parameter_value PLL_EXTRA_CLK_DESIRED_PHASE_GUI_8 0.0
set_component_parameter_value PLL_EXTRA_CLK_ACTUAL_PHASE_DEG_GUI_8 0.0
set_component_parameter_value PLL_EXTRA_CLK_DESIRED_DUTY_CYCLE_GUI_8 50.0
set_component_parameter_value PLL_EXTRA_CLK_ACTUAL_DUTY_CYCLE_GUI_8 50.0
set_component_parameter_value PLL_EXTRA_CLK_ACTUAL_DUTY_CYCLE_8 50.0
set_component_parameter_value PLL_VCO_CLK_FREQ_MHZ 1066.666666
set_component_parameter_value PLL_NUM_OF_EXTRA_CLKS 0
set_component_parameter_value PLL_EXTRA_CLK_ACTUAL_FREQ_MHZ_0 0.0
set_component_parameter_value PLL_EXTRA_CLK_ACTUAL_PHASE_PS_0 0.0
set_component_parameter_value PLL_EXTRA_CLK_ACTUAL_FREQ_MHZ_1 0.0
set_component_parameter_value PLL_EXTRA_CLK_ACTUAL_PHASE_PS_1 0.0
set_component_parameter_value PLL_EXTRA_CLK_ACTUAL_FREQ_MHZ_2 0.0
set_component_parameter_value PLL_EXTRA_CLK_ACTUAL_PHASE_PS_2 0.0
set_component_parameter_value PLL_EXTRA_CLK_ACTUAL_FREQ_MHZ_3 0.0
set_component_parameter_value PLL_EXTRA_CLK_ACTUAL_PHASE_PS_3 0.0
set_component_parameter_value PLL_EXTRA_CLK_ACTUAL_FREQ_MHZ_4 0.0
set_component_parameter_value PLL_EXTRA_CLK_ACTUAL_PHASE_PS_4 0.0
set_component_parameter_value PLL_EXTRA_CLK_ACTUAL_FREQ_MHZ_5 1066.667
set_component_parameter_value PLL_EXTRA_CLK_ACTUAL_PHASE_PS_5 0.0
set_component_parameter_value PLL_EXTRA_CLK_ACTUAL_FREQ_MHZ_6 1066.667
set_component_parameter_value PLL_EXTRA_CLK_ACTUAL_PHASE_PS_6 0.0
set_component_parameter_value PLL_EXTRA_CLK_ACTUAL_FREQ_MHZ_7 1066.667
set_component_parameter_value PLL_EXTRA_CLK_ACTUAL_PHASE_PS_7 0.0
set_component_parameter_value PLL_EXTRA_CLK_ACTUAL_FREQ_MHZ_8 1066.667
set_component_parameter_value PLL_EXTRA_CLK_ACTUAL_PHASE_PS_8 0.0
set_component_parameter_value PHY_DDR3_CONFIG_ENUM CONFIG_PHY_AND_HARD_CTRL
set_component_parameter_value PHY_DDR3_USER_PING_PONG_EN false
set_component_parameter_value PHY_DDR3_MEM_CLK_FREQ_MHZ 1066.667
set_component_parameter_value PHY_DDR3_DEFAULT_REF_CLK_FREQ true
set_component_parameter_value PHY_DDR3_USER_REF_CLK_FREQ_MHZ -1.0
set_component_parameter_value PHY_DDR3_REF_CLK_JITTER_PS 10.0
set_component_parameter_value PHY_DDR3_RATE_ENUM RATE_QUARTER
set_component_parameter_value PHY_DDR3_CORE_CLKS_SHARING_ENUM CORE_CLKS_SHARING_DISABLED
set_component_parameter_value PHY_DDR3_CORE_CLKS_SHARING_EXPOSE_SLAVE_OUT false
set_component_parameter_value PHY_DDR3_IO_VOLTAGE 1.5
set_component_parameter_value PHY_DDR3_DEFAULT_IO true
set_component_parameter_value PHY_DDR3_HPS_ENABLE_EARLY_RELEASE false
set_component_parameter_value PHY_DDR3_USER_PERIODIC_OCT_RECAL_ENUM PERIODIC_OCT_RECAL_AUTO
set_component_parameter_value PHY_DDR3_USER_DLL_CORE_UPDN_EN false
set_component_parameter_value PHY_DDR3_REF_CLK_FREQ_MHZ -1.0
set_component_parameter_value PHY_DDR3_PING_PONG_EN false
set_component_parameter_value PHY_DDR3_USER_AC_IO_STD_ENUM unset
set_component_parameter_value PHY_DDR3_USER_AC_MODE_ENUM unset
set_component_parameter_value PHY_DDR3_USER_AC_SLEW_RATE_ENUM SLEW_RATE_FAST
set_component_parameter_value PHY_DDR3_USER_CK_IO_STD_ENUM unset
set_component_parameter_value PHY_DDR3_USER_CK_MODE_ENUM unset
set_component_parameter_value PHY_DDR3_USER_CK_SLEW_RATE_ENUM SLEW_RATE_FAST
set_component_parameter_value PHY_DDR3_USER_DATA_IO_STD_ENUM unset
set_component_parameter_value PHY_DDR3_USER_DATA_OUT_MODE_ENUM unset
set_component_parameter_value PHY_DDR3_USER_DATA_IN_MODE_ENUM unset
set_component_parameter_value PHY_DDR3_USER_AUTO_STARTING_VREFIN_EN true
set_component_parameter_value PHY_DDR3_USER_STARTING_VREFIN 70.0
set_component_parameter_value PHY_DDR3_USER_PLL_REF_CLK_IO_STD_ENUM unset
set_component_parameter_value PHY_DDR3_USER_RZQ_IO_STD_ENUM unset
set_component_parameter_value PHY_DDR3_AC_IO_STD_ENUM unset
set_component_parameter_value PHY_DDR3_AC_MODE_ENUM unset
set_component_parameter_value PHY_DDR3_AC_SLEW_RATE_ENUM SLEW_RATE_FAST
set_component_parameter_value PHY_DDR3_CK_IO_STD_ENUM unset
set_component_parameter_value PHY_DDR3_CK_MODE_ENUM unset
set_component_parameter_value PHY_DDR3_CK_SLEW_RATE_ENUM SLEW_RATE_FAST
set_component_parameter_value PHY_DDR3_DATA_IO_STD_ENUM unset
set_component_parameter_value PHY_DDR3_DATA_OUT_MODE_ENUM unset
set_component_parameter_value PHY_DDR3_DATA_IN_MODE_ENUM unset
set_component_parameter_value PHY_DDR3_AUTO_STARTING_VREFIN_EN true
set_component_parameter_value PHY_DDR3_STARTING_VREFIN 70.0
set_component_parameter_value PHY_DDR3_PLL_REF_CLK_IO_STD_ENUM unset
set_component_parameter_value PHY_DDR3_RZQ_IO_STD_ENUM unset
set_component_parameter_value PHY_DDR3_CAL_ADDR0 0
set_component_parameter_value PHY_DDR3_CAL_ADDR1 8
set_component_parameter_value PHY_DDR3_CAL_ENABLE_NON_DES false
set_component_parameter_value PHY_DDR4_CONFIG_ENUM CONFIG_PHY_AND_HARD_CTRL
set_component_parameter_value PHY_DDR4_USER_PING_PONG_EN false
set_component_parameter_value PHY_DDR4_USER_CLAMSHELL_EN false
set_component_parameter_value PHY_DDR4_USER_DLL_CORE_UPDN_EN false
set_component_parameter_value PHY_DDR4_MEM_CLK_FREQ_MHZ 1066.666666
set_component_parameter_value PHY_DDR4_DEFAULT_REF_CLK_FREQ true
set_component_parameter_value PHY_DDR4_USER_REF_CLK_FREQ_MHZ -1.0
set_component_parameter_value PHY_DDR4_REF_CLK_JITTER_PS 10.0
set_component_parameter_value PHY_DDR4_RATE_ENUM RATE_QUARTER
set_component_parameter_value PHY_DDR4_CORE_CLKS_SHARING_ENUM CORE_CLKS_SHARING_DISABLED
set_component_parameter_value PHY_DDR4_CORE_CLKS_SHARING_EXPOSE_SLAVE_OUT false
set_component_parameter_value PHY_DDR4_IO_VOLTAGE 1.2
set_component_parameter_value PHY_DDR4_DEFAULT_IO false
set_component_parameter_value PHY_DDR4_HPS_ENABLE_EARLY_RELEASE false
set_component_parameter_value PHY_DDR4_USER_PERIODIC_OCT_RECAL_ENUM PERIODIC_OCT_RECAL_AUTO
set_component_parameter_value PHY_DDR4_REF_CLK_FREQ_MHZ 266.667
set_component_parameter_value PHY_DDR4_PING_PONG_EN false
set_component_parameter_value PHY_DDR4_CLAMSHELL_EN false
set_component_parameter_value PHY_DDR4_USER_AC_IO_STD_ENUM IO_STD_SSTL_12
set_component_parameter_value PHY_DDR4_USER_AC_MODE_ENUM OUT_OCT_40_CAL
set_component_parameter_value PHY_DDR4_USER_AC_SLEW_RATE_ENUM SLEW_RATE_FAST
set_component_parameter_value PHY_DDR4_USER_CK_IO_STD_ENUM IO_STD_SSTL_12
set_component_parameter_value PHY_DDR4_USER_CK_MODE_ENUM OUT_OCT_40_CAL
set_component_parameter_value PHY_DDR4_USER_CK_SLEW_RATE_ENUM SLEW_RATE_FAST
set_component_parameter_value PHY_DDR4_USER_DATA_IO_STD_ENUM IO_STD_POD_12
set_component_parameter_value PHY_DDR4_USER_DATA_OUT_MODE_ENUM OUT_OCT_34_CAL
set_component_parameter_value PHY_DDR4_USER_DATA_IN_MODE_ENUM IN_OCT_48_CAL
set_component_parameter_value PHY_DDR4_USER_AUTO_STARTING_VREFIN_EN true
set_component_parameter_value PHY_DDR4_USER_STARTING_VREFIN 70.0
set_component_parameter_value PHY_DDR4_USER_PLL_REF_CLK_IO_STD_ENUM IO_STD_LVDS_NO_OCT
set_component_parameter_value PHY_DDR4_USER_RZQ_IO_STD_ENUM IO_STD_CMOS_12
set_component_parameter_value PHY_DDR4_AC_IO_STD_ENUM IO_STD_SSTL_12
set_component_parameter_value PHY_DDR4_AC_MODE_ENUM OUT_OCT_40_CAL
set_component_parameter_value PHY_DDR4_AC_SLEW_RATE_ENUM SLEW_RATE_FAST
set_component_parameter_value PHY_DDR4_CK_IO_STD_ENUM IO_STD_SSTL_12
set_component_parameter_value PHY_DDR4_CK_MODE_ENUM OUT_OCT_40_CAL
set_component_parameter_value PHY_DDR4_CK_SLEW_RATE_ENUM SLEW_RATE_FAST
set_component_parameter_value PHY_DDR4_DATA_IO_STD_ENUM IO_STD_POD_12
set_component_parameter_value PHY_DDR4_DATA_OUT_MODE_ENUM OUT_OCT_34_CAL
set_component_parameter_value PHY_DDR4_DATA_IN_MODE_ENUM IN_OCT_48_CAL
set_component_parameter_value PHY_DDR4_AUTO_STARTING_VREFIN_EN true
set_component_parameter_value PHY_DDR4_STARTING_VREFIN 70.7
set_component_parameter_value PHY_DDR4_PLL_REF_CLK_IO_STD_ENUM IO_STD_LVDS_NO_OCT
set_component_parameter_value PHY_DDR4_RZQ_IO_STD_ENUM IO_STD_CMOS_12
set_component_parameter_value PHY_QDR2_CONFIG_ENUM CONFIG_PHY_AND_SOFT_CTRL
set_component_parameter_value PHY_QDR2_USER_PING_PONG_EN false
set_component_parameter_value PHY_QDR2_MEM_CLK_FREQ_MHZ 633.333
set_component_parameter_value PHY_QDR2_DEFAULT_REF_CLK_FREQ true
set_component_parameter_value PHY_QDR2_USER_REF_CLK_FREQ_MHZ -1.0
set_component_parameter_value PHY_QDR2_REF_CLK_JITTER_PS 10.0
set_component_parameter_value PHY_QDR2_RATE_ENUM RATE_HALF
set_component_parameter_value PHY_QDR2_CORE_CLKS_SHARING_ENUM CORE_CLKS_SHARING_DISABLED
set_component_parameter_value PHY_QDR2_CORE_CLKS_SHARING_EXPOSE_SLAVE_OUT false
set_component_parameter_value PHY_QDR2_IO_VOLTAGE 1.5
set_component_parameter_value PHY_QDR2_DEFAULT_IO true
set_component_parameter_value PHY_QDR2_HPS_ENABLE_EARLY_RELEASE false
set_component_parameter_value PHY_QDR2_USER_PERIODIC_OCT_RECAL_ENUM PERIODIC_OCT_RECAL_AUTO
set_component_parameter_value PHY_QDR2_USER_DLL_CORE_UPDN_EN false
set_component_parameter_value PHY_QDR2_REF_CLK_FREQ_MHZ -1.0
set_component_parameter_value PHY_QDR2_PING_PONG_EN false
set_component_parameter_value PHY_QDR2_USER_AC_IO_STD_ENUM unset
set_component_parameter_value PHY_QDR2_USER_AC_MODE_ENUM unset
set_component_parameter_value PHY_QDR2_USER_AC_SLEW_RATE_ENUM SLEW_RATE_FAST
set_component_parameter_value PHY_QDR2_USER_CK_IO_STD_ENUM unset
set_component_parameter_value PHY_QDR2_USER_CK_MODE_ENUM unset
set_component_parameter_value PHY_QDR2_USER_CK_SLEW_RATE_ENUM SLEW_RATE_FAST
set_component_parameter_value PHY_QDR2_USER_DATA_IO_STD_ENUM unset
set_component_parameter_value PHY_QDR2_USER_DATA_OUT_MODE_ENUM unset
set_component_parameter_value PHY_QDR2_USER_DATA_IN_MODE_ENUM unset
set_component_parameter_value PHY_QDR2_USER_AUTO_STARTING_VREFIN_EN true
set_component_parameter_value PHY_QDR2_USER_STARTING_VREFIN 70.0
set_component_parameter_value PHY_QDR2_USER_PLL_REF_CLK_IO_STD_ENUM unset
set_component_parameter_value PHY_QDR2_USER_RZQ_IO_STD_ENUM unset
set_component_parameter_value PHY_QDR2_AC_IO_STD_ENUM unset
set_component_parameter_value PHY_QDR2_AC_MODE_ENUM unset
set_component_parameter_value PHY_QDR2_AC_SLEW_RATE_ENUM SLEW_RATE_FAST
set_component_parameter_value PHY_QDR2_CK_IO_STD_ENUM unset
set_component_parameter_value PHY_QDR2_CK_MODE_ENUM unset
set_component_parameter_value PHY_QDR2_CK_SLEW_RATE_ENUM SLEW_RATE_FAST
set_component_parameter_value PHY_QDR2_DATA_IO_STD_ENUM unset
set_component_parameter_value PHY_QDR2_DATA_OUT_MODE_ENUM unset
set_component_parameter_value PHY_QDR2_DATA_IN_MODE_ENUM unset
set_component_parameter_value PHY_QDR2_AUTO_STARTING_VREFIN_EN true
set_component_parameter_value PHY_QDR2_STARTING_VREFIN 70.0
set_component_parameter_value PHY_QDR2_PLL_REF_CLK_IO_STD_ENUM unset
set_component_parameter_value PHY_QDR2_RZQ_IO_STD_ENUM unset
set_component_parameter_value PHY_QDR4_CONFIG_ENUM CONFIG_PHY_AND_SOFT_CTRL
set_component_parameter_value PHY_QDR4_USER_PING_PONG_EN false
set_component_parameter_value PHY_QDR4_MEM_CLK_FREQ_MHZ 1066.667
set_component_parameter_value PHY_QDR4_DEFAULT_REF_CLK_FREQ true
set_component_parameter_value PHY_QDR4_USER_REF_CLK_FREQ_MHZ -1.0
set_component_parameter_value PHY_QDR4_REF_CLK_JITTER_PS 10.0
set_component_parameter_value PHY_QDR4_RATE_ENUM RATE_QUARTER
set_component_parameter_value PHY_QDR4_CORE_CLKS_SHARING_ENUM CORE_CLKS_SHARING_DISABLED
set_component_parameter_value PHY_QDR4_CORE_CLKS_SHARING_EXPOSE_SLAVE_OUT false
set_component_parameter_value PHY_QDR4_IO_VOLTAGE 1.2
set_component_parameter_value PHY_QDR4_DEFAULT_IO true
set_component_parameter_value PHY_QDR4_HPS_ENABLE_EARLY_RELEASE false
set_component_parameter_value PHY_QDR4_USER_PERIODIC_OCT_RECAL_ENUM PERIODIC_OCT_RECAL_AUTO
set_component_parameter_value PHY_QDR4_USER_DLL_CORE_UPDN_EN false
set_component_parameter_value PHY_QDR4_REF_CLK_FREQ_MHZ -1.0
set_component_parameter_value PHY_QDR4_PING_PONG_EN false
